# EAGLE design heart_rate_sensor_module (EAGLE 9.6.2)
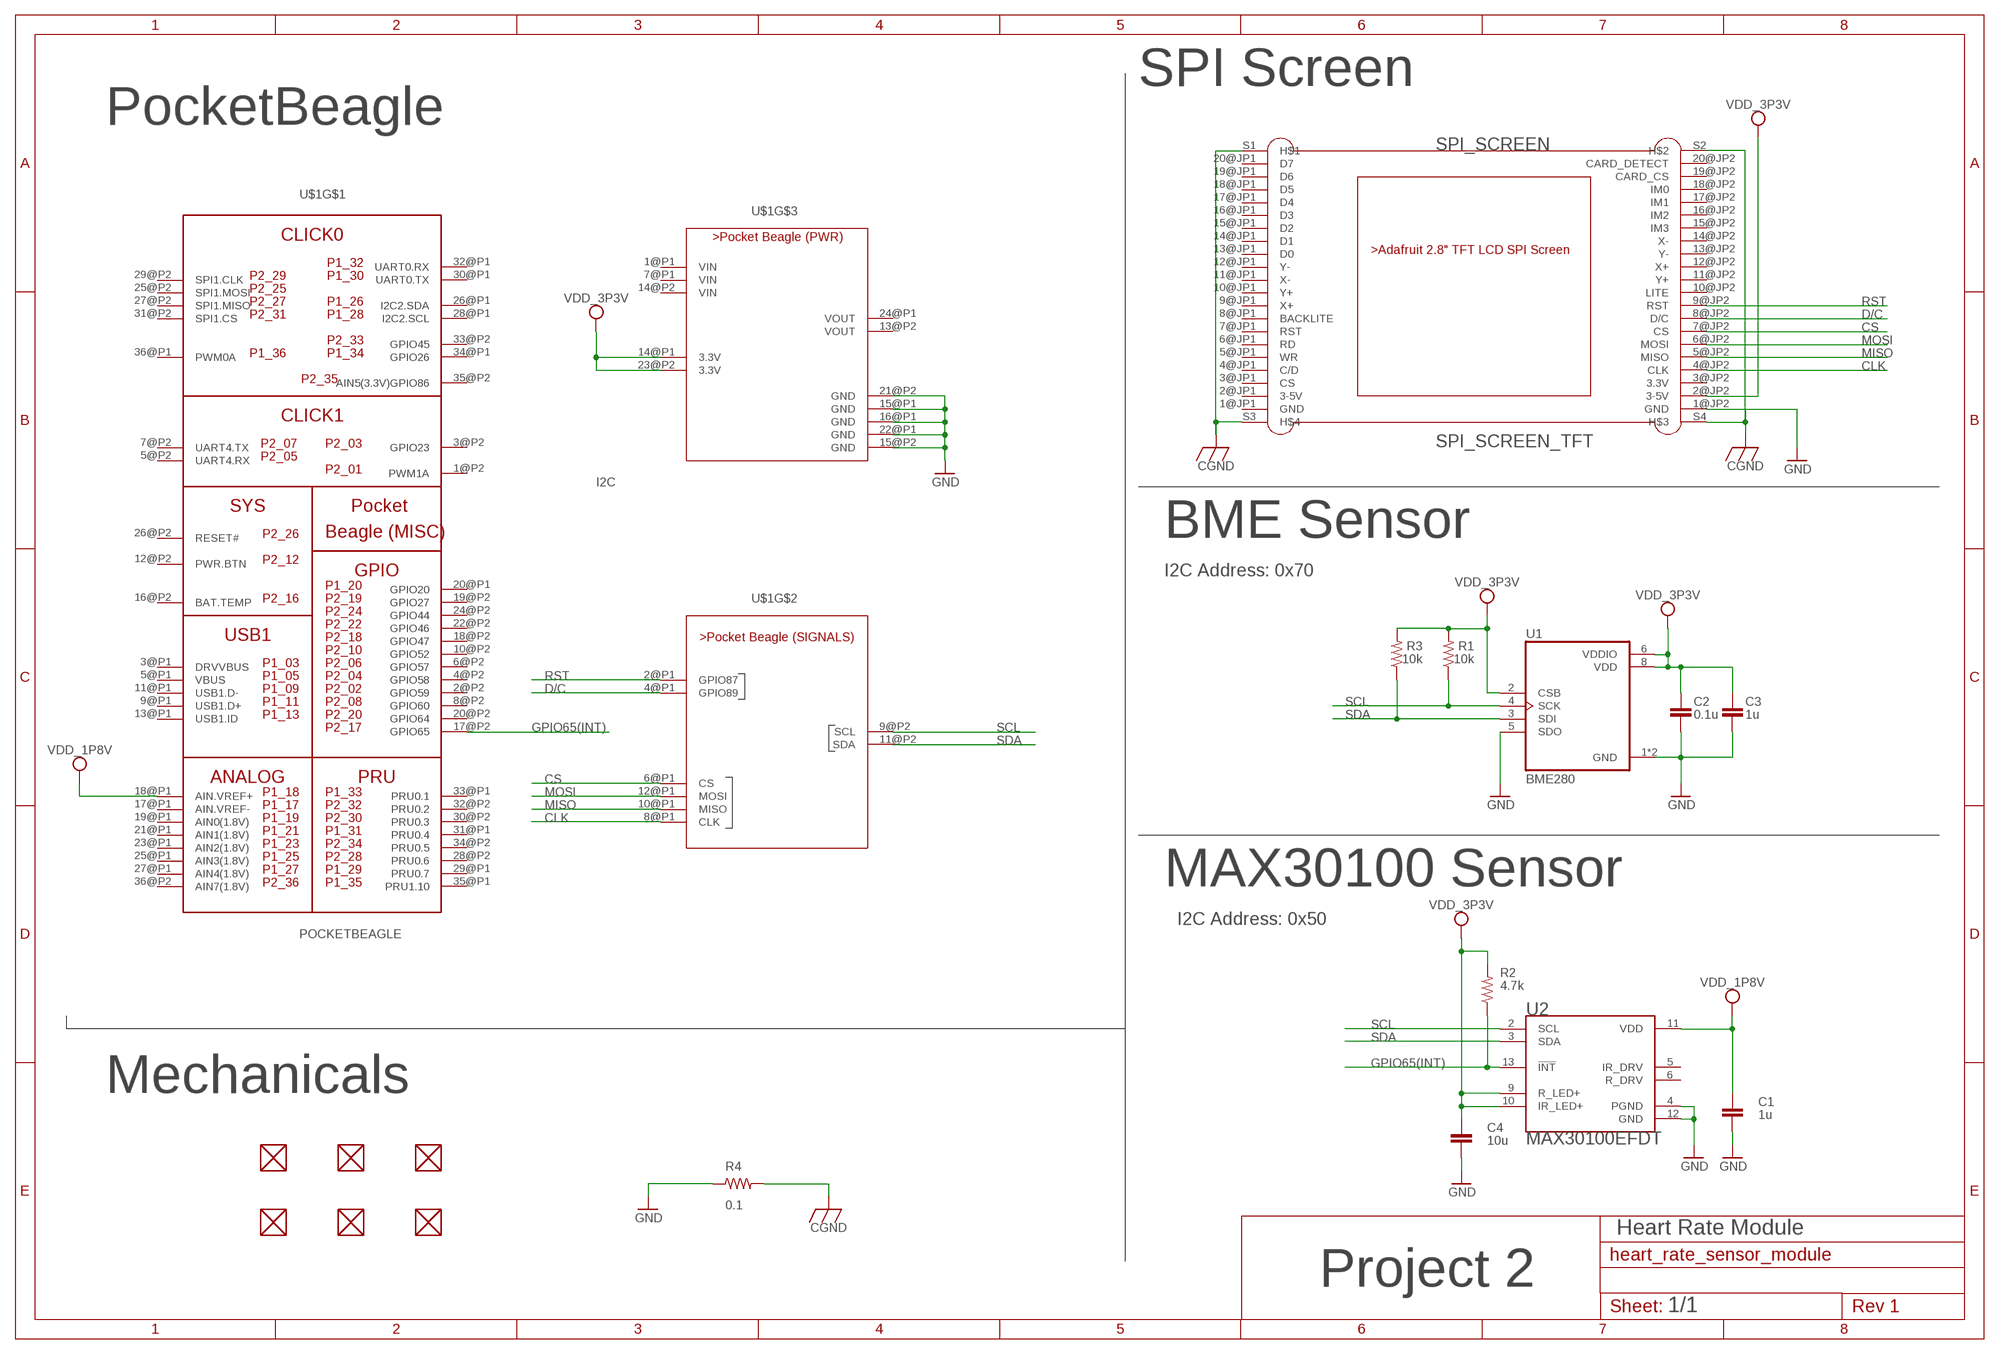
[diagram p0: schematic, sheet 1]

## Parts
C1  1u  C_C0603  [C0603]
C2  0.1u  C_C0603  [C0603]
C3  1u  C_C0603  [C0603]
C4  10u  C_C0603  [C0603]
FUD1  FIDUCIAL  [FIDUCIAL_40MIL]
FUD2  FIDUCIAL  [FIDUCIAL_40MIL]
FUD3  FIDUCIAL  [FIDUCIAL_40MIL]
FUD4  FIDUCIAL  [FIDUCIAL_40MIL]
FUD5  FIDUCIAL  [FIDUCIAL_40MIL]
FUD6  FIDUCIAL  [FIDUCIAL_40MIL]
R1  10k  R_R0603  [R0603]
R2  4.7k  R_R0603  [R0603]
R3  10k  R_R0603  [R0603]
R4  0.1  R_R0805  [R0805]
SPI_SCREEN  SPI_SCREEN_TFT  [SPI_SREEN_TFT]
U1  BME280  [PSON65P250X250X100-8N]
U2  MAX30100EFDT  [LGA14R80P2X7_560X280X130]
U$1  POCKETBEAGLE  [POCKETBEAGLE]

## Nets
CGND: R4.2 SPI_SCREEN.S1(H$1) SPI_SCREEN.S2(H$2) SPI_SCREEN.S3(H$4) SPI_SCREEN.S4(H$3)
CLK: SPI_SCREEN.4@JP2(CLK) U$1.8@P1(CLK)
CS: SPI_SCREEN.7@JP2(CS) U$1.6@P1(CS)
D/C: SPI_SCREEN.8@JP2(D/C) U$1.4@P1(GPIO89)
GND: C1.2 C2.2 C3.2 C4.2 R4.1 SPI_SCREEN.1@JP2(GND) U1.1(GND) U1.5(SDO) U1.7(GND) U2.4(PGND) U2.12(GND) U$1.15@P1(GND) U$1.15@P2(GND) U$1.16@P1(GND) U$1.21@P2(GND) U$1.22@P1(GND)
GPIO65(INT): R2.1 U2.13(!INT) U$1.17@P2(GPIO65)
MISO: SPI_SCREEN.5@JP2(MISO) U$1.10@P1(MISO)
MOSI: SPI_SCREEN.6@JP2(MOSI) U$1.12@P1(MOSI)
RST: SPI_SCREEN.9@JP2(RST) U$1.2@P1(GPIO87)
SCL: R1.1 U1.4(SCK) U2.2(SCL) U$1.9@P2(SCL)
SDA: R3.1 U1.3(SDI) U2.3(SDA) U$1.11@P2(SDA)
VDD_1P8V: C1.1 U2.11(VDD) U$1.18@P1(AIN.VREF+)
VDD_3P3V: C2.1 C3.1 C4.1 R1.2 R2.2 R3.2 SPI_SCREEN.2@JP2(3-5V) U1.2(CSB) U1.6(VDDIO) U1.8(VDD) U2.9(R_LED+) U2.10(IR_LED+) U$1.14@P1(3.3V) U$1.23@P2(3.3V)
Unconnected: FUD1.P$1 FUD2.P$1 FUD3.P$1 FUD4.P$1 FUD5.P$1 FUD6.P$1 SPI_SCREEN.1@JP1(GND) SPI_SCREEN.2@JP1(3-5V) SPI_SCREEN.3@JP1(CS) SPI_SCREEN.3@JP2(3.3V) SPI_SCREEN.4@JP1(C/D) SPI_SCREEN.5@JP1(WR) SPI_SCREEN.6@JP1(RD) SPI_SCREEN.7@JP1(RST) SPI_SCREEN.8@JP1(BACKLITE) SPI_SCREEN.9@JP1(X+) SPI_SCREEN.10@JP1(Y+) SPI_SCREEN.10@JP2(LITE) SPI_SCREEN.11@JP1(X-) SPI_SCREEN.11@JP2(Y+) SPI_SCREEN.12@JP1(Y-) SPI_SCREEN.12@JP2(X+) SPI_SCREEN.13@JP1(D0) SPI_SCREEN.13@JP2(Y-) SPI_SCREEN.14@JP1(D1) SPI_SCREEN.14@JP2(X-) SPI_SCREEN.15@JP1(D2) SPI_SCREEN.15@JP2(IM3) SPI_SCREEN.16@JP1(D3) SPI_SCREEN.16@JP2(IM2) SPI_SCREEN.17@JP1(D4) SPI_SCREEN.17@JP2(IM1) SPI_SCREEN.18@JP1(D5) SPI_SCREEN.18@JP2(IM0) SPI_SCREEN.19@JP1(D6) SPI_SCREEN.19@JP2(CARD_CS) SPI_SCREEN.20@JP1(D7) SPI_SCREEN.20@JP2(CARD_DETECT) U2.5(IR_DRV) U2.6(R_DRV) U$1.1@P1(VIN) U$1.1@P2(PWM1A) U$1.2@P2(GPIO59) U$1.3@P1(DRVVBUS) U$1.3@P2(GPIO23) U$1.4@P2(GPIO58) U$1.5@P1(VBUS) U$1.5@P2(UART4.RX) U$1.6@P2(GPIO57) U$1.7@P1(VIN) U$1.7@P2(UART4.TX) U$1.8@P2(GPIO60) U$1.9@P1(USB1.D+) U$1.10@P2(GPIO52) U$1.11@P1(USB1.D-) U$1.12@P2(PWR.BTN) U$1.13@P1(USB1.ID) U$1.13@P2(VOUT) U$1.14@P2(VIN) U$1.16@P2(BAT.TEMP) U$1.17@P1(AIN.VREF-) U$1.18@P2(GPIO47) U$1.19@P1(AIN0(1.8V)) U$1.19@P2(GPIO27) U$1.20@P1(GPIO20) U$1.20@P2(GPIO64) U$1.21@P1(AIN1(1.8V)) U$1.22@P2(GPIO46) U$1.23@P1(AIN2(1.8V)) U$1.24@P1(VOUT) U$1.24@P2(GPIO44) U$1.25@P1(AIN3(1.8V)) U$1.25@P2(SPI1.MOSI) U$1.26@P1(I2C2.SDA) U$1.26@P2(RESET#) U$1.27@P1(AIN4(1.8V)) U$1.27@P2(SPI1.MISO) U$1.28@P1(I2C2.SCL) U$1.28@P2(PRU0.6) U$1.29@P1(PRU0.7) U$1.29@P2(SPI1.CLK) U$1.30@P1(UART0.TX) U$1.30@P2(PRU0.3) U$1.31@P1(PRU0.4) U$1.31@P2(SPI1.CS) U$1.32@P1(UART0.RX) U$1.32@P2(PRU0.2) U$1.33@P1(PRU0.1) U$1.33@P2(GPIO45) U$1.34@P1(GPIO26) U$1.34@P2(PRU0.5) U$1.35@P1(PRU1.10) U$1.35@P2(AIN5(3.3V)GPIO86) U$1.36@P1(PWM0A) U$1.36@P2(AIN7(1.8V))

## Notes on the sheet
- SPI Screen
- PocketBeagle
- I2C
- BME Sensor
- I2C Address: 0x70
- MAX30100 Sensor
- I2C Address: 0x50
- Mechanicals
- Heart Rate Module
- Project 2
- 1/1

## Library data of the parts
C1-C4 = Project2:C_: Capacitor SMD. Sizes: 0402, 0603 & 0805
FUD1-FUD6 = combo_lock:FIDUCIAL
R1-R3 = Project2:R_: RESISTOR, American symbol
R4 = combo_lock:R_: RESISTOR, American symbol
SPI_SCREEN = Project2:SPI_SCREEN_TFT: Adafruit SPI Screen. Data sheet: https://learn.adafruit.com/adafruit-2-8-and-3-2-color-tft-touchscreen-breakout-v2/downloads
U1 = Project2:BME280: DIGITAL HUMIDITY, PRESSURE AND TEMPERATURE SENSOR * Digital interface I²C (up to 3.4 MHz) and SPI (3 and 4 wire, up to 10 MHz)* Supply voltage VDD main supply voltage range: 1.71 V to 3.6 V*VDDIO interface voltage range: 1.2 V to 3.6 V Operating range -40…+85 °C, 0…100 % rel. humidity, 300…1100 hPa The library has been designed by Richard Magdycz <https://www.facebook.com/groups/eaglecadsoftUK> Check availability <https://pricing.snapeda.com/parts/BME280/Bosch/view-part?ref=eda>; AVAILABILITY: In Stock; DESCRIPTION: Board Mount Humidity Sensors MEMS humidity, pressure and temperature sensor; MF: Bosch; MP: BME280; PACKAGE: LGA-8 Bosch; PRICE: None; PURCHASE-URL: https://pricing.snapeda.com/search/part/BME280/?ref=eda
U2 = Project2:MAX30100EFDT: Pulse Oximeter and Heart-Rate Sensor IC 14-Pin OLGA Check availability <https://pricing.snapeda.com/parts/MAX30100EFD/Maxim%20Integrated/view-part?ref=eda>; AVAILABILITY: In Stock; DESCRIPTION: Biometric Sensors Integrated Optical Sensor; MF: Maxim Integrated; MP: MAX30100EFD; PACKAGE: None; PRICE: None; PURCHASE-URL: https://pricing.snapeda.com/search/part/MAX30100EFD/?ref=eda
U$1 = Project2:POCKETBEAGLE: Pocket Beagle board

## Board
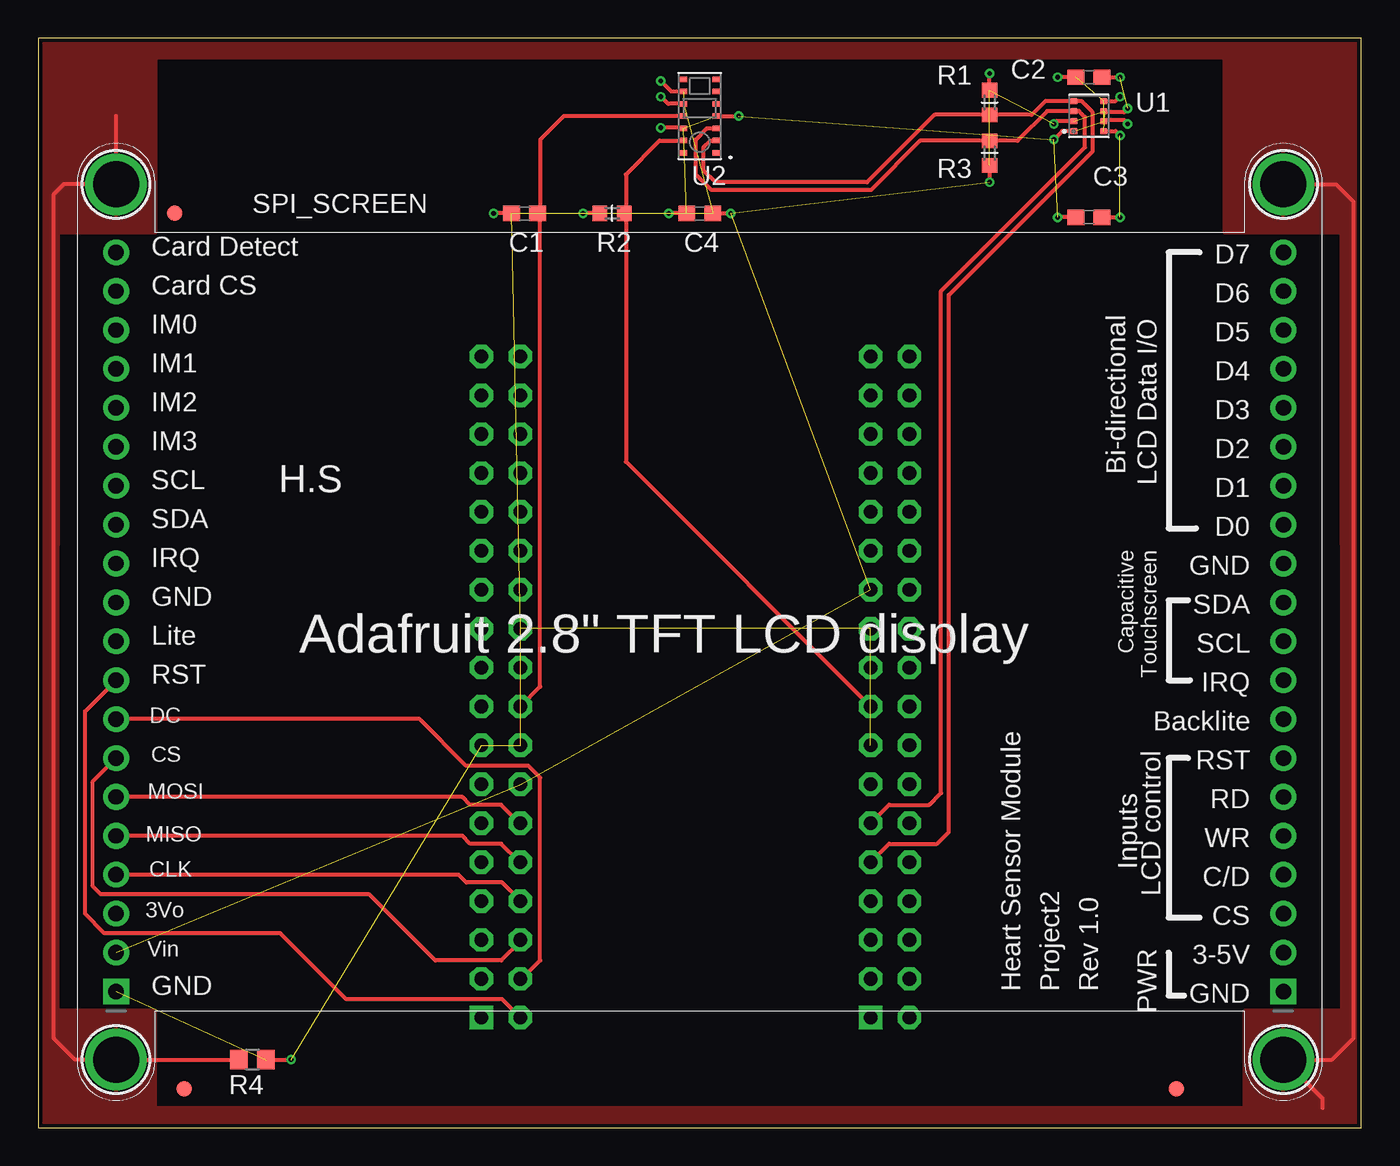
[diagram p1: board, top side]
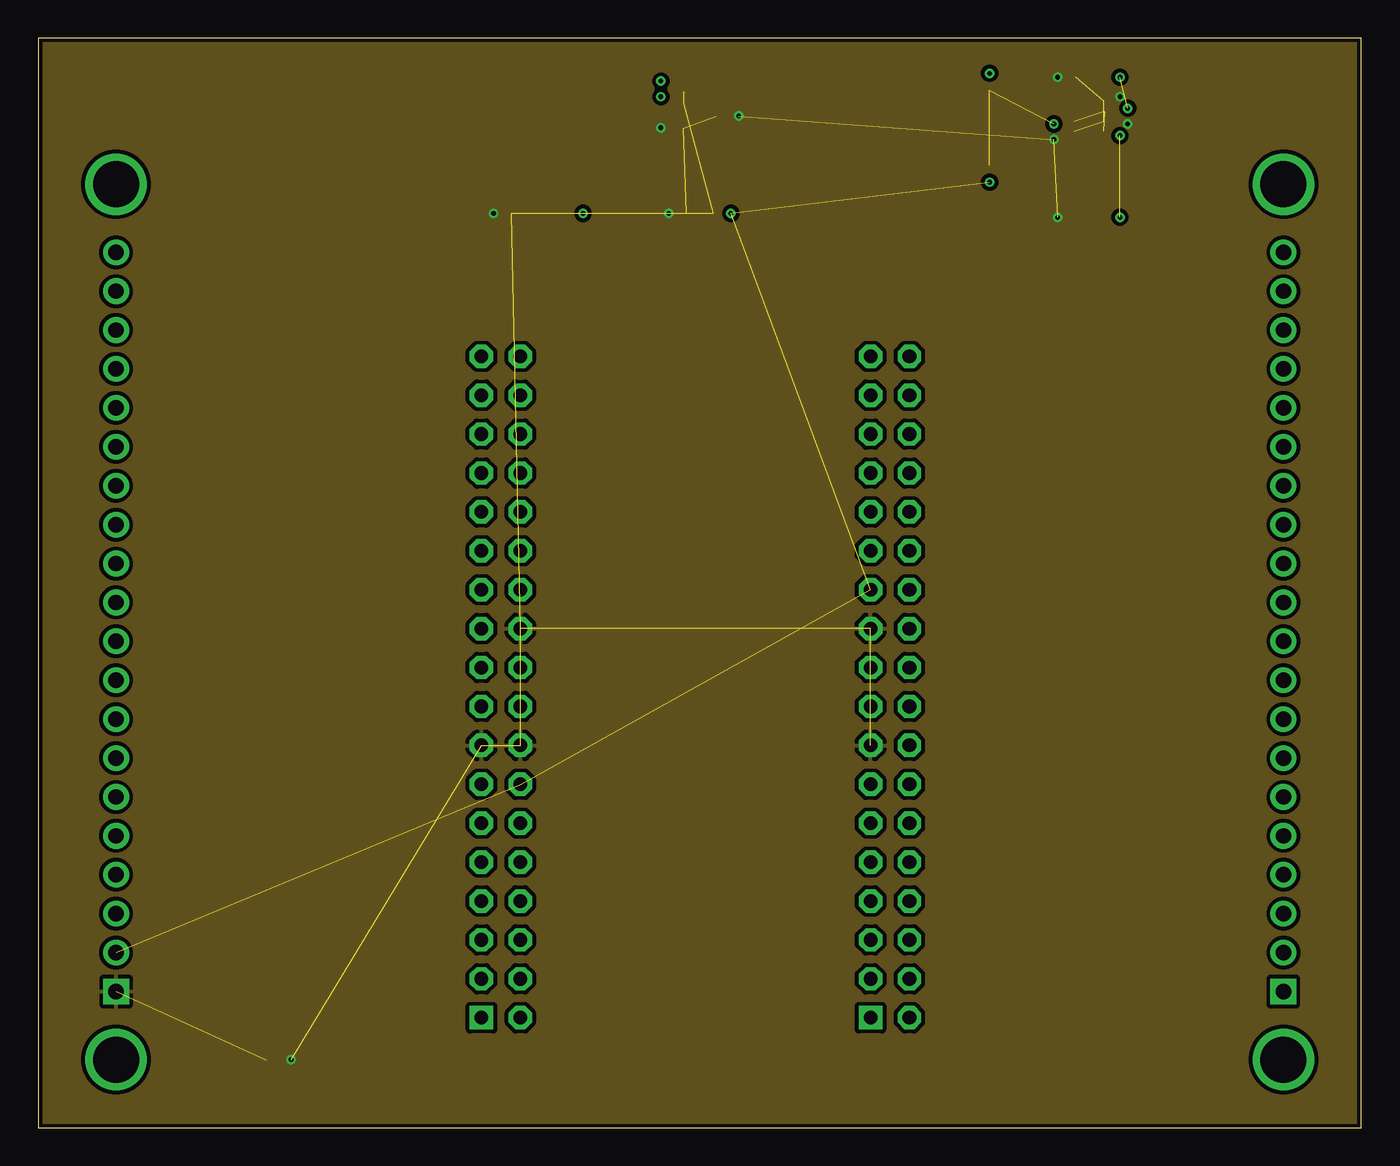
[diagram p2: board, inner layer Route2]
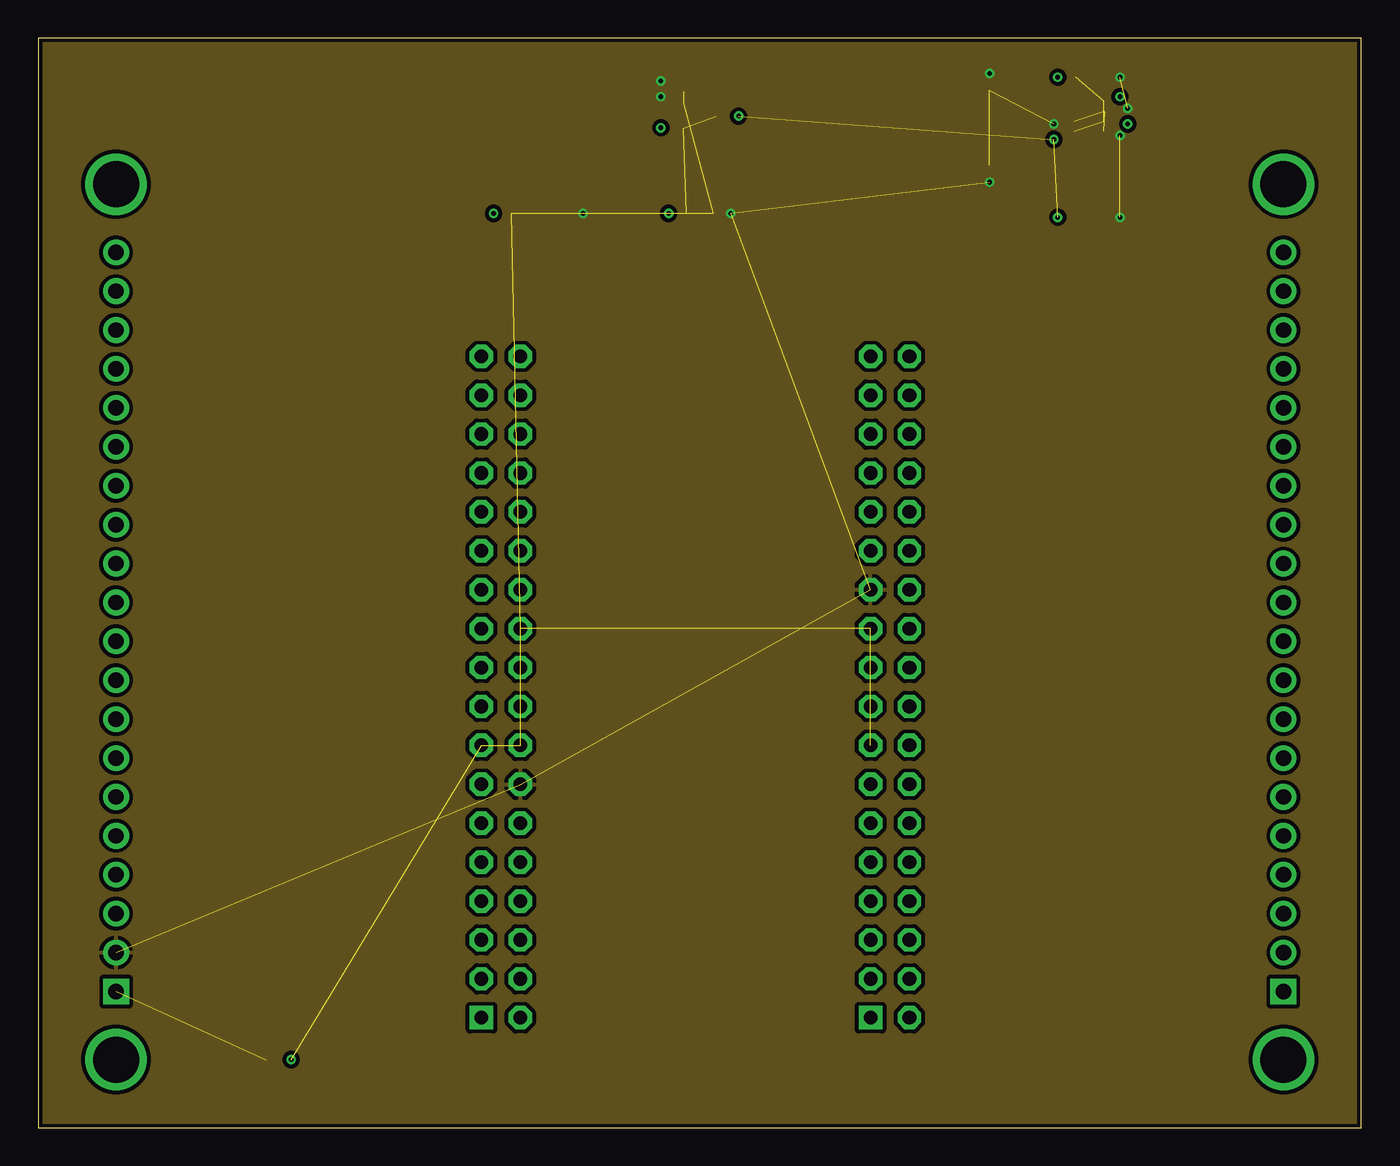
[diagram p3: board, inner layer Route15]
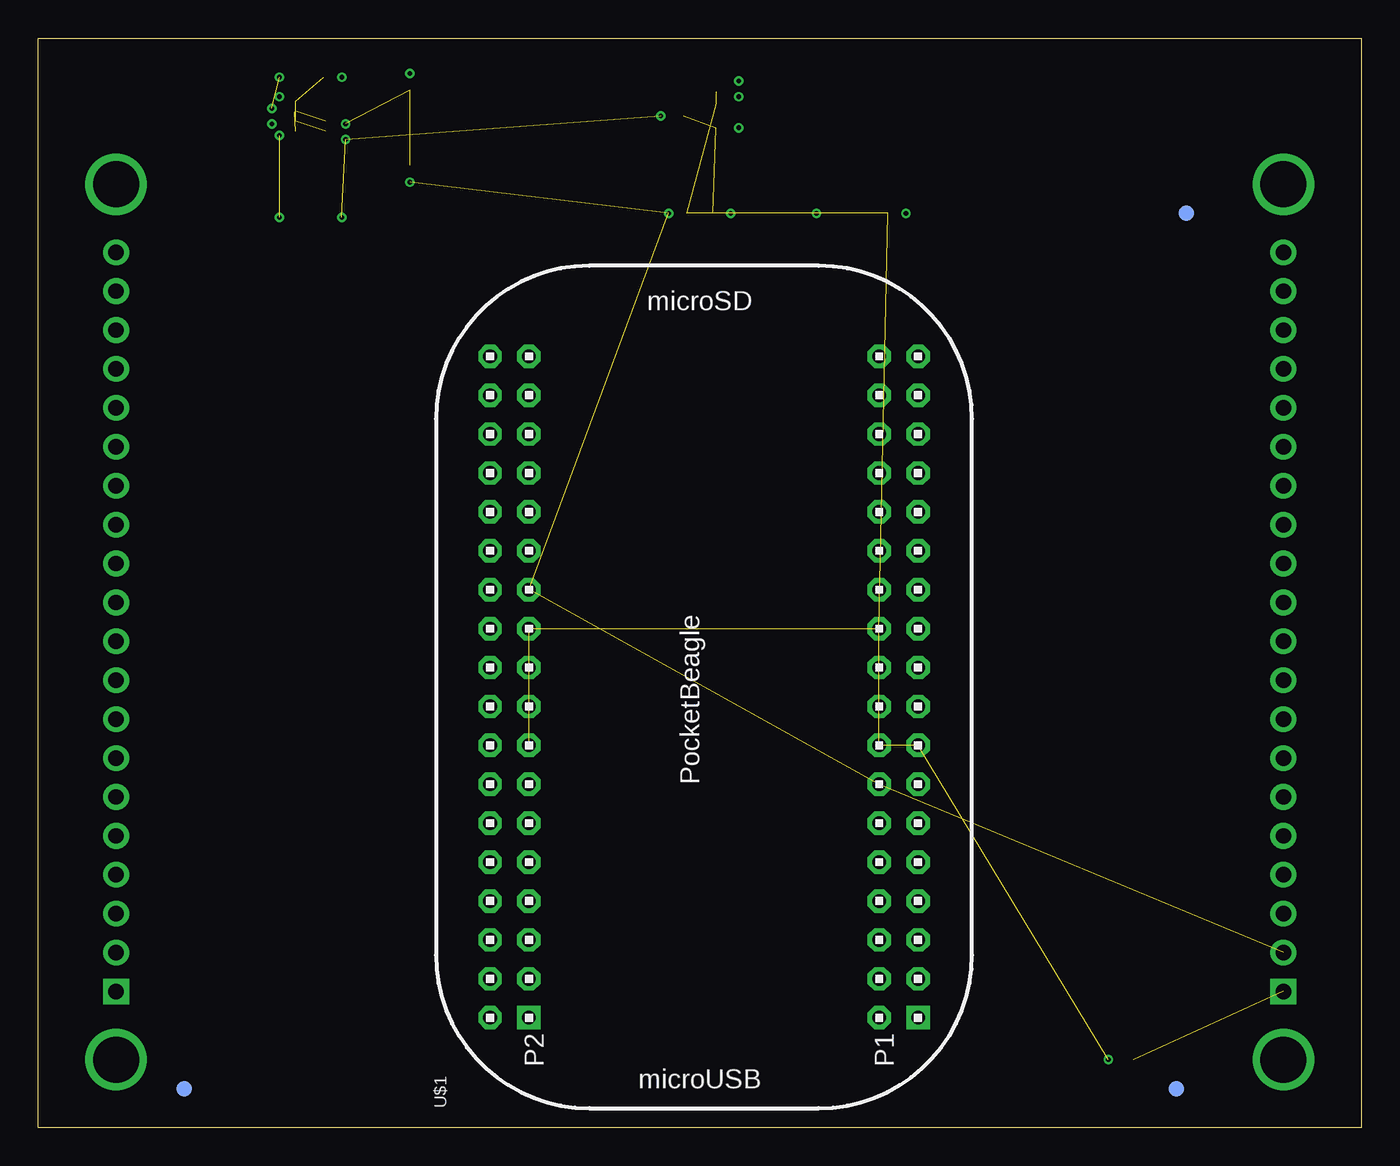
[diagram p4: board, bottom side, seen from below]

Size 86.36 x 71.12 mm. Coordinates in mm from the lower left corner, seen from the top.
Outline: 0,0 86.36,0 86.36,71.12 0,71.12 0,0
Copper layers (1*2*15*16): Top 0.035mm / dielectric 0.23mm / Route2 0.035mm / dielectric 0.93mm / Route15 0.035mm / dielectric 0.23mm / Bottom 0.035mm
Design rules "ENGI301_4lyr": minimum track width 10mil, minimum drill 12mil, track to track 10mil, track to pad 10mil, pad to pad 10mil, via to via 10mil, smd to smd 10mil, copper to edge 10mil, drill to drill 12mil, minimum pad ring 6mil, minimum via ring 6mil, stop-mask expansion 3mil, vias tented up to drill 25mil, thermal gap 10mil

### Footprints (pad centres in the part's own frame; a part is rotated, then mirrored left to right if it is on the bottom)
C0603 = smd 1.1 x 1: 1 -0.85,0; 2 0.85,0
FIDUCIAL_40MIL = smd 1.016 x 1.016: P$1 0,0
R0603 = smd 0.95 x 1.031: 1 -0.8,0; 2 0.8,0
R0805 = smd 1.143 x 1.27: 1 -0.889,0; 2 0.889,0
SPI_SREEN_TFT = drill 1 pad 1.676 square: 1@JP1 24.13,38.1; 1@JP2 24.13,-38.1 | drill 1 pad 1.676: 2@JP1 21.59,38.1; 2@JP2 21.59,-38.1; 3@JP1 19.05,38.1; 3@JP2 19.05,-38.1; 4@JP1 16.51,38.1; 4@JP2 16.51,-38.1; 5@JP1 13.97,38.1; 5@JP2 13.97,-38.1; 6@JP1 11.43,38.1; 6@JP2 11.43,-38.1; 7@JP1 8.89,38.1; 7@JP2 8.89,-38.1; 8@JP1 6.35,38.1; 8@JP2 6.35,-38.1; 9@JP1 3.81,38.1; 9@JP2 3.81,-38.1; 10@JP1 1.27,38.1; 10@JP2 1.27,-38.1; 11@JP1 -1.27,38.1; 11@JP2 -1.27,-38.1; 12@JP1 -3.81,38.1; 12@JP2 -3.81,-38.1; 13@JP1 -6.35,38.1; 13@JP2 -6.35,-38.1; 14@JP1 -8.89,38.1; 14@JP2 -8.89,-38.1; 15@JP1 -11.43,38.1; 15@JP2 -11.43,-38.1; 16@JP1 -13.97,38.1; 16@JP2 -13.97,-38.1; 17@JP1 -16.51,38.1; 17@JP2 -16.51,-38.1; 18@JP1 -19.05,38.1; 18@JP2 -19.05,-38.1; 19@JP1 -21.59,38.1; 19@JP2 -21.59,-38.1; 20@JP1 -24.13,38.1; 20@JP2 -24.13,-38.1 | drill 3 pad 3.6: S1 -28.575,38.1; S2 28.575,38.1; S3 -28.575,-38.1; S4 28.575,-38.1
PSON65P250X250X100-8N = smd 0.49 x 0.45: 1 0.97,0.975; 2 0.97,0.325; 3 0.97,-0.325; 4 0.97,-0.975; 5 -0.97,-0.975; 6 -0.97,-0.325; 7 -0.97,0.325; 8 -0.97,0.975
LGA14R80P2X7_560X280X130 = smd 0.5 x 0.35: 1 -1.075,2.4; 2 -1.075,1.6; 3 -1.075,0.8; 4 -1.075,0; 5 -1.075,-0.8; 6 -1.075,-1.6; 7 -1.075,-2.4; 8 1.075,-2.4; 9 1.075,-1.6; 10 1.075,-0.8; 11 1.075,0; 12 1.075,0.8; 13 1.075,1.6; 14 1.075,2.4
POCKETBEAGLE = drill 0.889 pad 1.524 square: 1@P1 5.91,3.53; 1@P2 5.91,28.93 | drill 0.889 pad 1.524 octagon: 2@P1 5.91,6.07; 2@P2 5.91,31.47; 3@P1 8.45,3.53; 3@P2 8.45,28.93; 4@P1 8.45,6.07; 4@P2 8.45,31.47; 5@P1 10.99,3.53; 5@P2 10.99,28.93; 6@P1 10.99,6.07; 6@P2 10.99,31.47; 7@P1 13.53,3.53; 7@P2 13.53,28.93; 8@P1 13.53,6.07; 8@P2 13.53,31.47; 9@P1 16.07,3.53; 9@P2 16.07,28.93; 10@P1 16.07,6.07; 10@P2 16.07,31.47; 11@P1 18.61,3.53; 11@P2 18.61,28.93; 12@P1 18.61,6.07; 12@P2 18.61,31.47; 13@P1 21.15,3.53; 13@P2 21.15,28.93; 14@P1 21.15,6.07; 14@P2 21.15,31.47; 15@P1 23.69,3.53; 15@P2 23.69,28.93; 16@P1 23.69,6.07; 16@P2 23.69,31.47; 17@P1 26.23,3.53; 17@P2 26.23,28.93; 18@P1 26.23,6.07; 18@P2 26.23,31.47; 19@P1 28.77,3.53; 19@P2 28.77,28.93; 20@P1 28.77,6.07; 20@P2 28.77,31.47; 21@P1 31.31,3.53; 21@P2 31.31,28.93; 22@P1 31.31,6.07; 22@P2 31.31,31.47; 23@P1 33.85,3.53; 23@P2 33.85,28.93; 24@P1 33.85,6.07; 24@P2 33.85,31.47; 25@P1 36.39,3.53; 25@P2 36.39,28.93; 26@P1 36.39,6.07; 26@P2 36.39,31.47; 27@P1 38.93,3.53; 27@P2 38.93,28.93; 28@P1 38.93,6.07; 28@P2 38.93,31.47; 29@P1 41.47,3.53; 29@P2 41.47,28.93; 30@P1 41.47,6.07; 30@P2 41.47,31.47; 31@P1 44.01,3.53; 31@P2 44.01,28.93; 32@P1 44.01,6.07; 32@P2 44.01,31.47; 33@P1 46.55,3.53; 33@P2 46.55,28.93; 34@P1 46.55,6.07; 34@P2 46.55,31.47; 35@P1 49.09,3.53; 35@P2 49.09,28.93; 36@P1 49.09,6.07; 36@P2 49.09,31.47

### Placement (x,y rotation side)
C1  31.75,59.69 180 top
C2  68.58,68.58 180 top
C3  68.58,59.44 180 top
C4  43.18,59.69 180 top
FUD1  9.53,2.54 0 top
FUD2  74.3,2.54 0 top
FUD3  8.89,59.69 0 top
FUD4  76.83,2.54 0 bottom
FUD5  11.43,59.69 0 bottom
FUD6  12.06,2.54 0 bottom
R1  62.1,66.93 90 top
R2  37.47,59.69 180 top
R3  62.1,63.63 270 top
R4  13.97,4.45 180 top
SPI_SCREEN  43.18,33.02 270 top
U1  68.58,66.04 180 top
U2  43.18,66.04 180 top
U$1  25.4,1.27 90 bottom

### Tracks (layer width: path | path; a pad name or v marks a point on that pad's centre or on a via)
CGND
  Top 0.254: R4.2 SPI_SCREEN.S4 2.41,4.45 1.02,5.84 1.02,60.96 1.65,61.59 SPI_SCREEN.S3 5.08,66.04 | 83.82,1.27 83.82,1.91 SPI_SCREEN.S2 84.45,4.45 85.85,5.84 85.85,60.45 84.71,61.59 SPI_SCREEN.S1
  pour Top: -1.27,38.1 -1.27,72.39 87.63,72.39 87.63,38.1 85.09,38.1 85.09,58.42 77.47,58.42 77.47,69.85 7.62,69.85 7.62,58.42 1.27,58.42 1.27,38.1
  pour Top: -1.27,38.1 -1.27,-1.27 87.63,-1.27 87.63,38.1 85.09,38.1 85.09,7.62 78.74,7.62 78.74,1.27 7.62,1.27 7.62,7.62 1.27,7.62 1.27,38.1
CLK
  Top 0.254: U$1.8@P1 30.27,16 27.94,16 27.43,16.51 SPI_SCREEN.4@JP2
CS
  Top 0.254: U$1.6@P1 31.47,12.17 30.23,10.92 25.91,10.92 21.59,15.24 4.06,15.24 3.56,15.75 3.56,22.61 SPI_SCREEN.7@JP2
D/C
  Top 0.254: SPI_SCREEN.8@JP2 24.89,26.67 27.94,23.62 32,23.62 32.77,22.86 32.77,10.92 31.56,9.72 U$1.4@P1
GND  (via drill 0.3 pad 0.61)  (15 unrouted)
  Top 0.254: C4.2 v41.15,59.69 | C1.2 v29.72,59.69 | C2.2 v66.55,68.58 | C3.2 v66.55,59.44 | U1.5 70.31,67.02 v70.61,67.31 | U2.4 v45.72,66.04 | U2.12 42.07,65.28 v40.64,65.28 | U1.7 69.62,65.79 70.87,65.79 v71.12,65.53 | U1.1 66.84,65.06 v66.29,64.52 | R4.1 v16.51,4.45
  pour Route2 (rank 6): -2.54,73.66 88.9,73.66 88.9,-2.54 -2.54,-2.54
GPIO65(INT)
  Top 0.254: U$1.17@P2 38.35,43.48 38.35,59.6 R2.1 38.35,59.78 38.35,62.23 40.56,64.44 U2.13
MISO
  Top 0.254: U$1.10@P1 31.43,17.34 30.23,18.54 28.19,18.54 27.69,19.05 SPI_SCREEN.5@JP2
MOSI
  Top 0.254: U$1.12@P1 31.43,19.88 30.23,21.08 28.19,21.08 27.69,21.59 SPI_SCREEN.6@JP2
RST
  Top 0.254: U$1.2@P1 30.27,8.38 20.11,8.38 15.79,12.7 4.32,12.7 3.05,13.97 3.05,27.18 SPI_SCREEN.9@JP2
SCL
  Top 0.254: U$1.9@P2 55.53,18.54 58.67,18.54 59.44,19.3 59.44,54.36 68.83,63.75 68.83,66.29 68.11,67.02 U1.4 65.75,67.02 64.86,66.13 R1.1 58.51,66.13 54.1,61.72 44.2,61.72 43.43,62.48 43.43,64.01 43.87,64.44 U2.2
SDA
  Top 0.254: U$1.11@P2 55.53,21.08 58.17,21.08 58.93,21.84 58.93,54.61 68.33,64.01 68.33,65.97 67.94,66.36 U1.3 65.86,66.36 63.92,64.43 R3.1 57.57,64.43 54.36,61.21 43.94,61.21 42.93,62.23 42.93,64.52 43.65,65.24 U2.3
VDD_1P8V
  Top 0.254: U2.11 34.29,66.04 32.77,64.52 32.77,59.86 C1.1 32.77,59.52 32.77,28.8 U$1.18@P1
VDD_3P3V  (via drill 0.3 pad 0.61)  (14 unrouted)
  Top 0.254: C4.1 v45.21,59.69 | C2.1 v70.61,68.58 | C3.1 v70.61,59.44 | R1.2 v62.1,68.83 | R2.2 v35.56,59.69 | U1.8 70.32,65.06 v70.61,64.77 | R3.2 v62.1,61.72 | U2.10 41.11,66.84 v40.64,67.31 | 69.62,66.29 70.87,66.29 v71.12,66.55 | U1.2 66.48,65.72 v66.29,65.53 | U2.9 41.33,67.64 v40.64,68.33
  pour Route15 (rank 6): -5.08,76.2 91.44,76.2 91.44,-5.08 -5.08,-5.08

### Text on the board
tPlace: H.S | Heart Sensor Module | Project2 | Rev 1.0
200bmp: C:/Users/hs65/Downloads/logo1.bmp